# EasyEDA schematic SCH_VoltageRegulator_2021-10-16.json
TITLE: Experiment No. 8 - Voltage Regulator; REV: 1.0; Date: 2021-10-04; Sheet: 1/1; Drawn By: Aryaman Mishra; Company: 19BCE1027
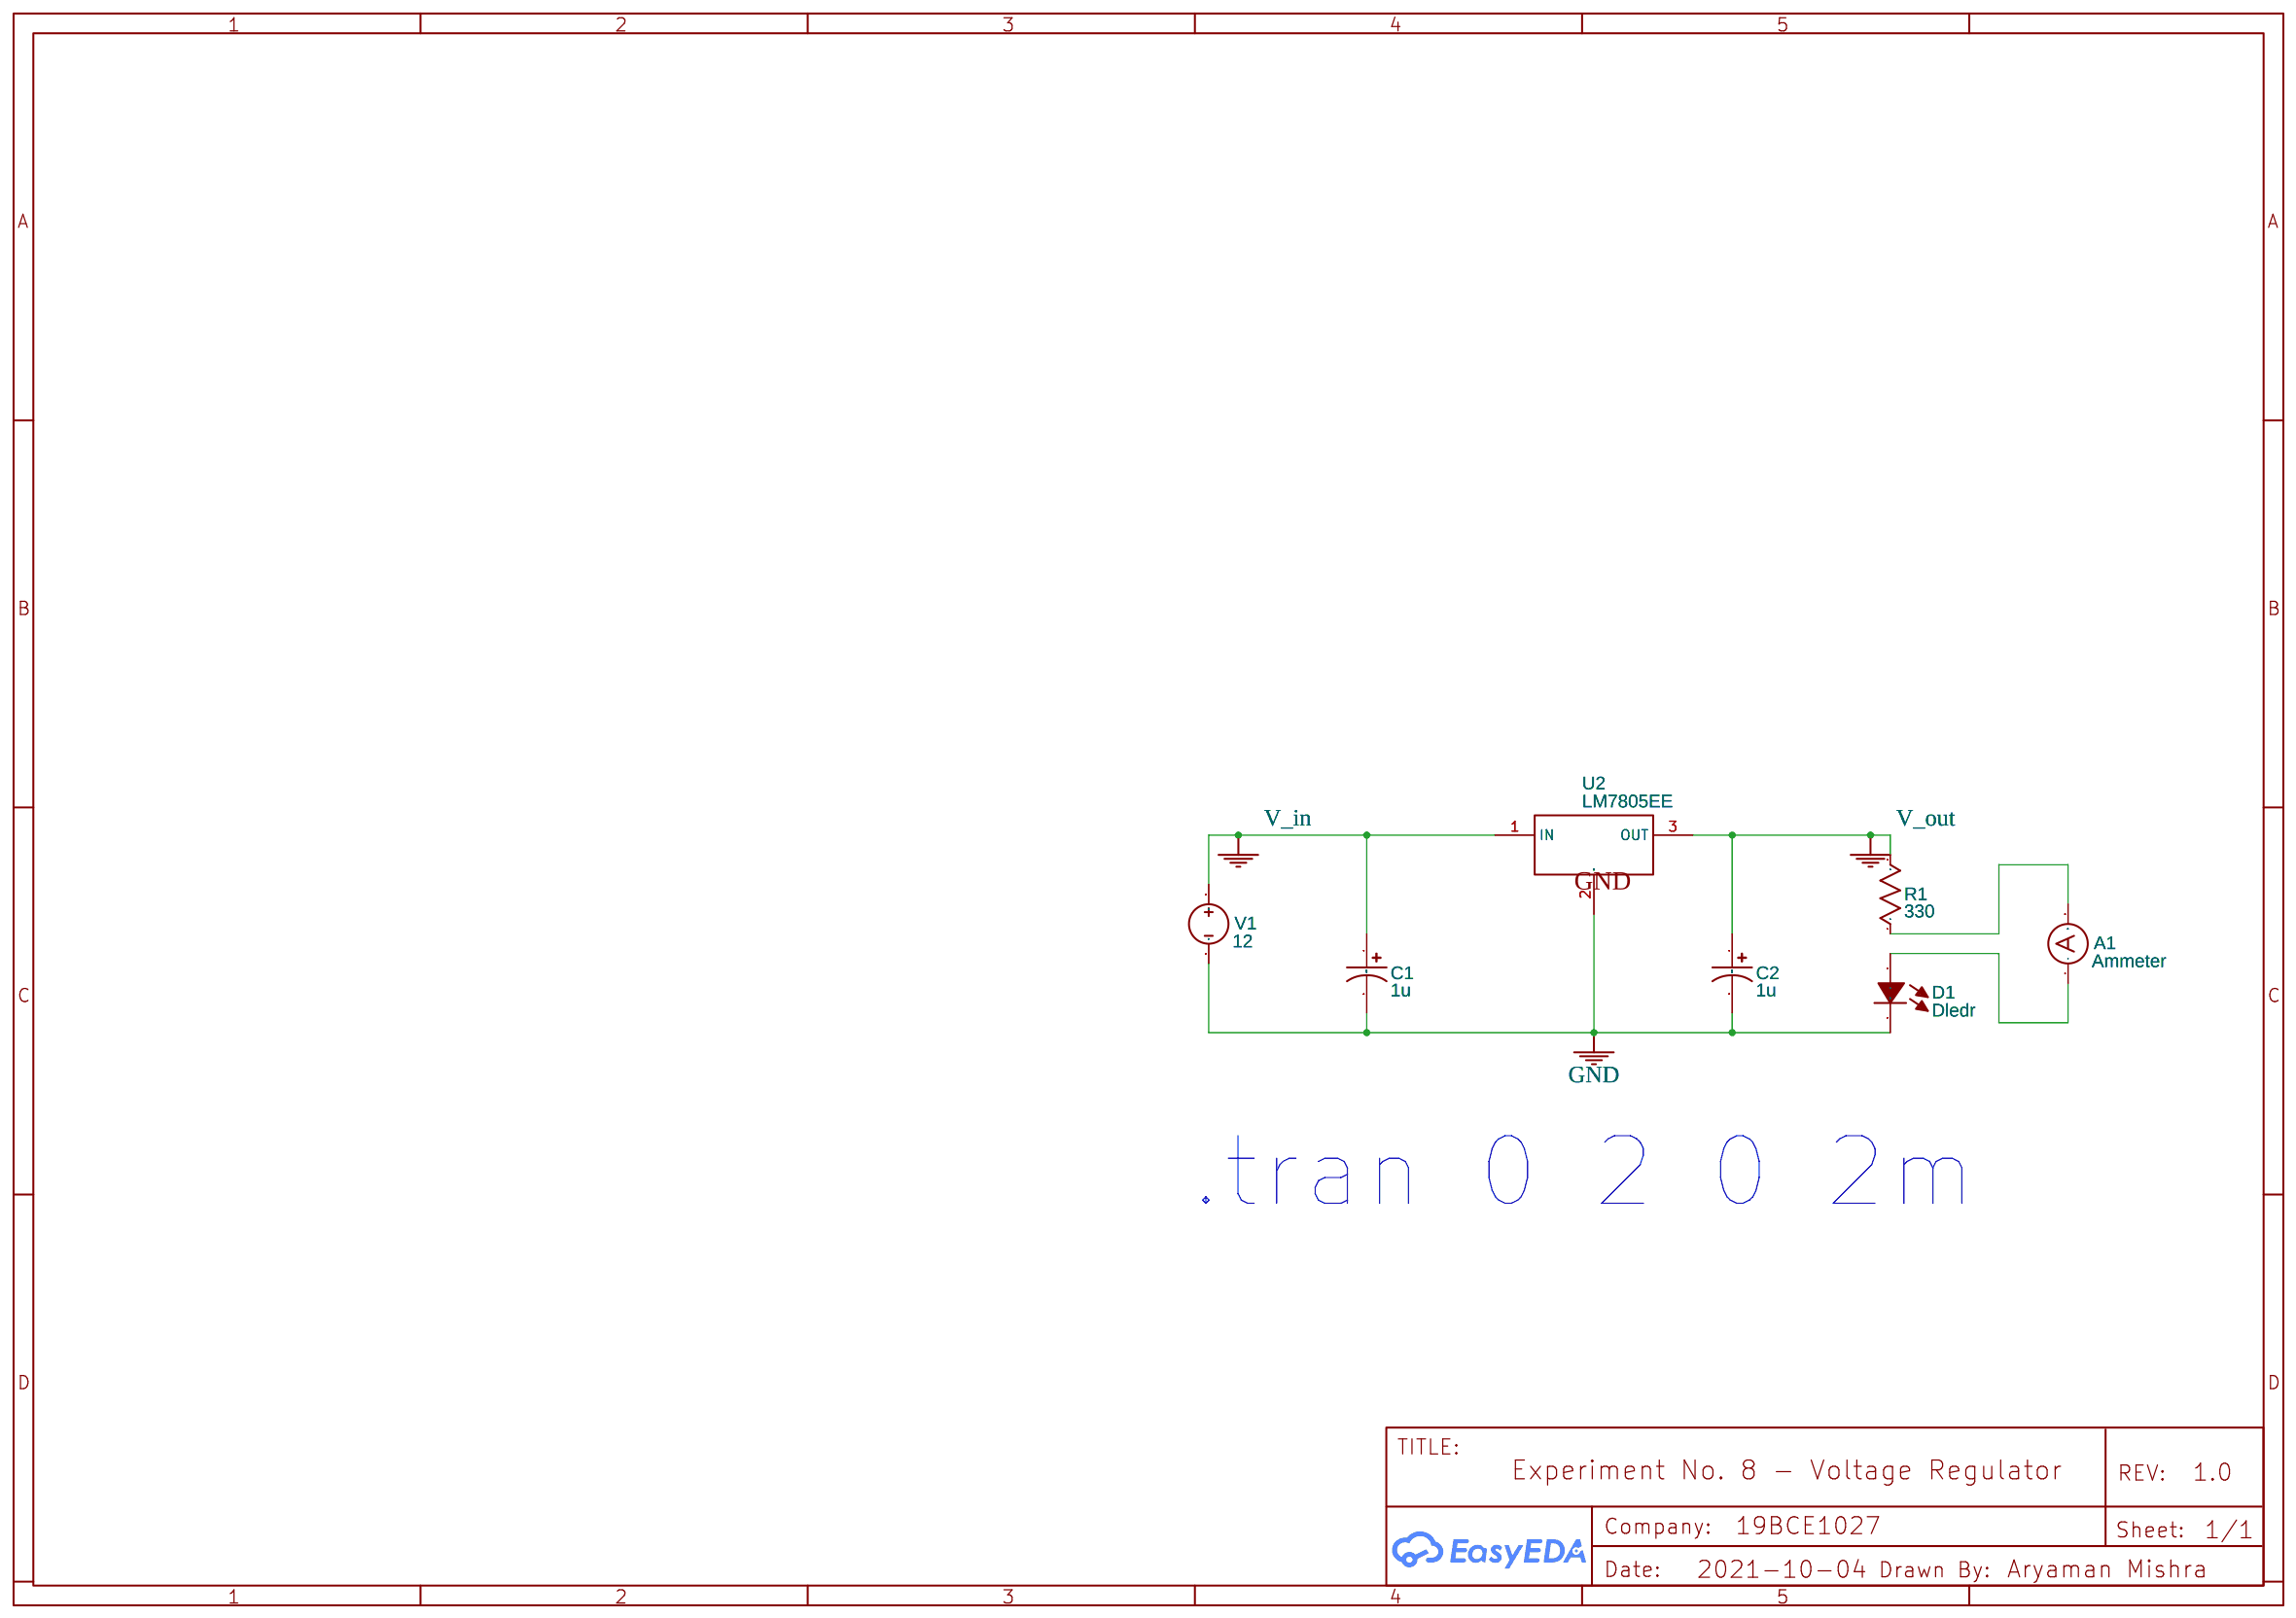
[diagram p0: schematic sheet]

## Parts
A1  Ammeter
C1  1u  [CAP-D4.0×H5.5]
C2  1u  [CAP-D4.0×H5.5]
D1  Dledr  [LED3MM]
R1  330  [R0603]
U2  LM7805EE  [TO-220(TO-220-3)]
V1  12  [HDR1X2]

## Library data of the parts
A1 = AMMETER: Contributor: Linus02
C1 C2 = CE_SMD_D4.0×H5.5_US: Contributor: LCEDA_Lib
D1 = DLEDR: sourceId: 39lVhsq0A; sim: true
R1 = R_0603_US: Contributor: LCEDA_Lib
U2 = 78XX: Contributor: EasyEDA
V1 = VDC: Contributor: EasyEDA; sim: true

## Nets
GND: C1.2 C2.2 D1.2(C) U2.2(GND) V1.2
V_in: C1.1 U2.1(IN) V1.1
V_out: C2.1 R1.2 U2.3(OUT)
Net-(A1-1): A1.1(+) D1.1(A)
Net-(A1-2): A1.2 R1.1

## Notes on the sheet
- .tran 0 2 0 2m
